# EAGLE design serge_tkb_led_mod (EAGLE 8.7.1)
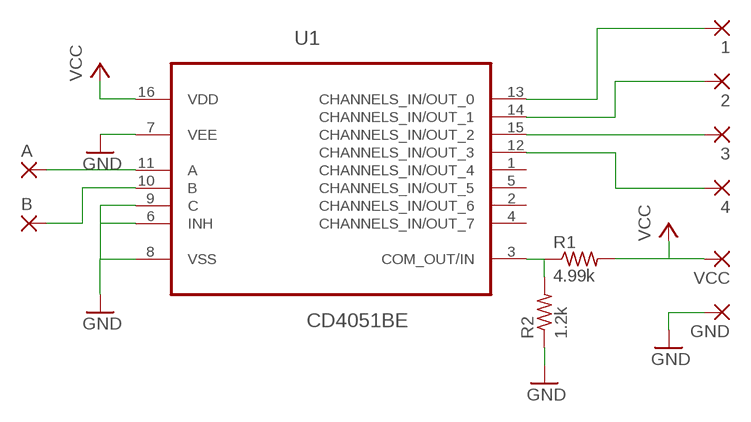
[diagram p0: schematic, sheet 1]

## Parts
1  3,17/1,3  [3,17/1,3]
2  3,17/1,3  [3,17/1,3]
3  3,17/1,3  [3,17/1,3]
4  3,17/1,3  [3,17/1,3]
A  3,17/1,3  [3,17/1,3]
B  3,17/1,3  [3,17/1,3]
GND  3,17/1,3  [3,17/1,3]
R1  4.99k  R-US_0207/10  [0207/10]
R2  1.2k  R-US_0207/10  [0207/10]
U1  CD4051BE  [DIP254P762X508-16]
VCC  3,17/1,3  [3,17/1,3]

## Nets
A: A.1(P) U1.11(A)
GND: GND.1(P) R2.1 U1.6(INH) U1.7(VEE) U1.8(VSS) U1.9(C)
N$1: R1.1 R2.2 U1.3(COM_OUT/IN)
N$2: 1.1(P) U1.13(CHANNELS_IN/OUT_0)
N$3: 2.1(P) U1.14(CHANNELS_IN/OUT_1)
N$4: 3.1(P) U1.15(CHANNELS_IN/OUT_2)
N$5: 4.1(P) U1.12(CHANNELS_IN/OUT_3)
N$8: B.1(P) U1.10(B)
VCC: R1.2 U1.16(VDD) VCC.1(P)
Unconnected: U1.1(CHANNELS_IN/OUT_4) U1.2(CHANNELS_IN/OUT_6) U1.4(CHANNELS_IN/OUT_7) U1.5(CHANNELS_IN/OUT_5)

## Library data of the parts
1-4 A B GND VCC = wirepad:3,17/1,3: THROUGH-HOLE PAD
R1 R2 = resistor:R-US_: RESISTOR, American symbol
U1 = Texas Instruments_By_element14_Batch_1:CD4051BE: The CD4051B is a single 8-Channel multiplexer having three binary control inputs.; MPN: CD4051BE; OC_FARNELL: 1106109; OC_NEWARK: 60K5119; PACKAGE: PDIP-16; SUPPLIER: Texas Instruments

## Net classes
0 default: width 0.305 mm, drill 0.508 mm, clearance 0.254 mm

## Board
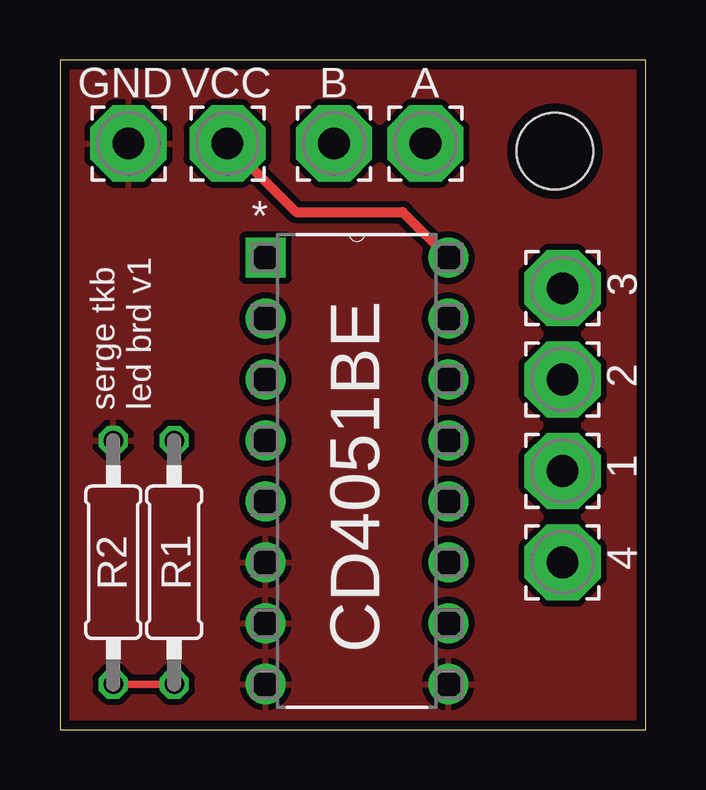
[diagram p1: board, top side]
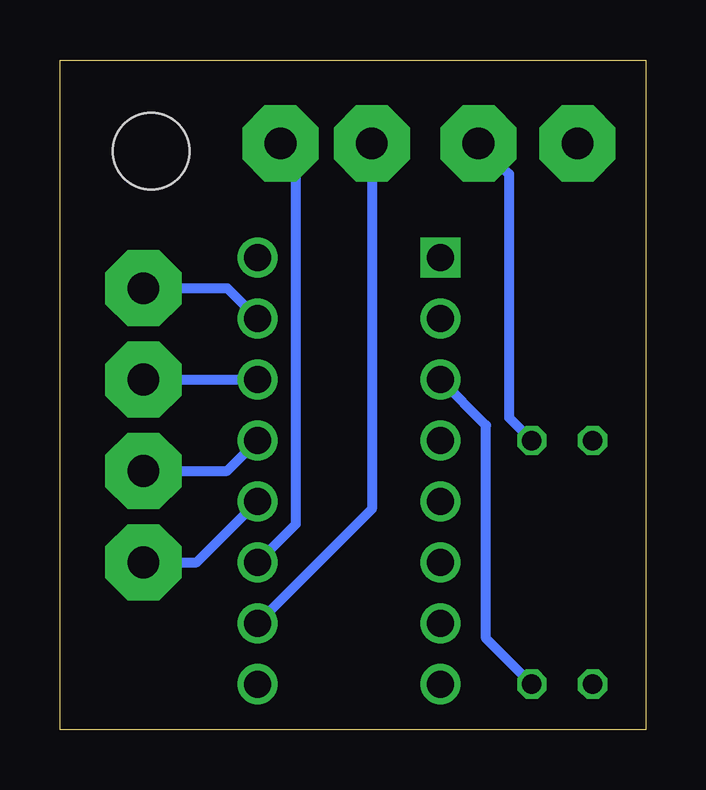
[diagram p2: board, bottom side, seen from below]

Size 24.43 x 27.93 mm. Coordinates in mm from the lower left corner, seen from the top.
Outline: 0,0 24.43,0 24.43,27.93 0,27.93 0,0
Copper layers (1*16): Top 0.0356mm / dielectric 1.5011mm / Bottom 0.0356mm
Design rules "LaenPCBOrder": minimum track width 6mil, minimum drill 13mil, track to track 6mil, track to pad 6mil, pad to pad 6mil, via to via 6mil, smd to smd 6mil, copper to edge 15mil, drill to drill 6mil, minimum pad ring 7mil, minimum via ring 7mil, stop-mask expansion 3mil, vias tented up to drill 0mil, thermal gap 10mil
Holes 3.2 mm at 20.64,24.13

### Footprints (pad centres in the part's own frame; a part is rotated, then mirrored left to right if it is on the bottom)
3,17/1,3 = drill 1.321 pad 3.175 octagon: 1 0,0
0207/10 = drill 0.813 octagon: 1 -5.08,0; 2 5.08,0
DIP254P762X508-16 = drill 1.118 square: 1 -7.62,17.78 | drill 1.118: 2 -7.62,15.24; 3 -7.62,12.7; 4 -7.62,10.16; 5 -7.62,7.62; 6 -7.62,5.08; 7 -7.62,2.54; 8 -7.62,0; 9 0,0; 10 0,2.54; 11 0,5.08; 12 0,7.62; 13 0,10.16; 14 0,12.7; 15 0,15.24; 16 0,17.78

### Placement (x,y rotation side)
1  20.95,10.79 180 top
2  20.95,14.61 180 top
3  20.95,18.41 180 top
4  20.95,6.99 180 top
A  15.24,24.45 180 top
B  11.43,24.45 180 top
GND  2.86,24.45 180 top
R1  4.76,6.99 90 top
R2  2.22,6.99 270 top
U1  16.19,1.91 0 top
VCC  6.99,24.45 180 top

### Tracks (layer width: path | path; a pad name or v marks a point on that pad's centre or on a via)
A
  Bottom 0.406: A.1 14.61,23.81 14.61,8.57 U1.11
GND
  pour Top: -0.64,28.57 25.4,28.57 25.4,-0.64 -0.64,-0.64
N$1
  Top 0.305: R2.2 R1.1
  Bottom 0.406: R1.1 6.67,3.81 6.67,12.7 U1.3
N$2
  Bottom 0.406: 1.1 17.46,10.79 U1.13
N$3
  Bottom 0.406: 2.1 U1.14
N$4
  Bottom 0.406: 3.1 17.46,18.41 U1.15
N$5
  Bottom 0.406: 4.1 18.73,6.99 U1.12
N$8
  Bottom 0.406: B.1 11.43,9.21 U1.10
VCC
  Top 0.406: VCC.1 9.84,21.59 14.29,21.59 U1.16
  Bottom 0.406: VCC.1 5.71,23.18 5.71,13.02 R1.2

### Text on the board
tNames: serge tkb / led brd v1